# EAGLE design pic32 (EAGLE 5.12)
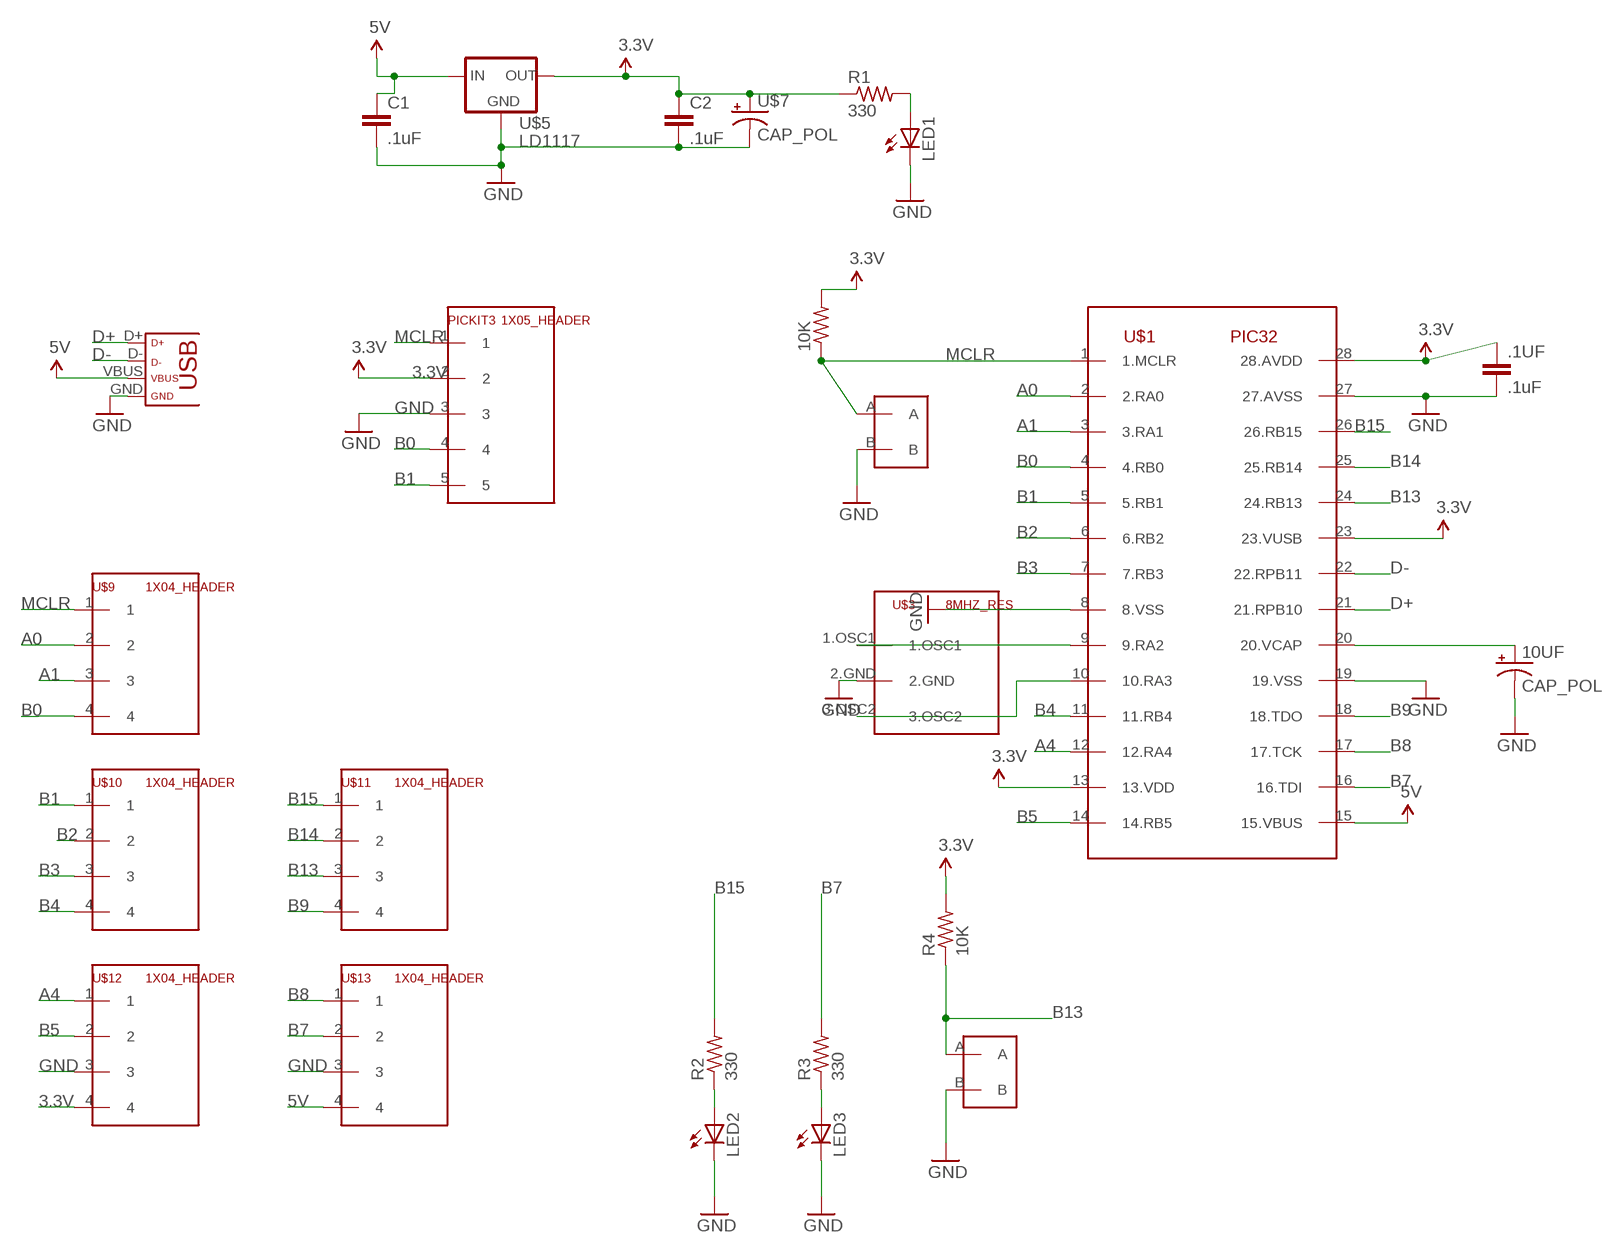
[diagram p0: schematic, sheet 1]

## Parts
10K  R-US_0309/12  [0309/12]
10UF  CAP_POL  [CAP_POL_D]
.1UF  .1uF  C-EU025-025X050  [C025-025X050]
C1  .1uF  C-EU025-025X050  [C025-025X050]
C2  .1uF  C-EU025-025X050  [C025-025X050]
LED1  LED3MM  [LED3MM]
LED2  LED3MM  [LED3MM]
LED3  LED3MM  [LED3MM]
PICKIT3  1X05_HEADER  [1X05]
R1  330  R-US_0309/12  [0309/12]
R2  330  R-US_0309/12  [0309/12]
R3  330  R-US_0309/12  [0309/12]
R4  10K  R-US_0309/12  [0309/12]
U$1  PIC32  [DIL28-4]
U$2  2_LEAD_PUSH  [2_LEAD_PUSH]
U$3  8MHZ_RES  [8MHZ_RES]
U$5  LD1117  [TO220]
U$7  CAP_POL  [CAP_POL_D]
U$8  2_LEAD_PUSH  [2_LEAD_PUSH]
U$9  1X04_HEADER  [1X04]
U$10  1X04_HEADER  [1X04]
U$11  1X04_HEADER  [1X04]
U$12  1X04_HEADER  [1X04]
U$13  1X04_HEADER  [1X04]
U$14  USB  [USB-MINIB]

## Nets
3.3V: 10K.2 .1UF.1 C2.1 PICKIT3.2 R1.1 R4.2 U$1.13(13.VDD) U$1.23(23.VUSB) U$1.28(28.AVDD) U$5.2(OUT) U$7.1(+) U$12.4
5V: C1.1 U$1.15(15.VBUS) U$5.3(IN) U$13.4 U$14.VBUS
A0: U$1.2(2.RA0) U$9.2
A1: U$1.3(3.RA1) U$9.3
A4: U$1.12(12.RA4) U$12.1
B0: PICKIT3.4 U$1.4(4.RB0) U$9.4
B1: PICKIT3.5 U$1.5(5.RB1) U$10.1
B2: U$1.6(6.RB2) U$10.2
B3: U$1.7(7.RB3) U$10.3
B4: U$1.11(11.RB4) U$10.4
B5: U$1.14(14.RB5) U$12.2
B7: R3.2 U$1.16(16.TDI) U$13.2
B8: U$1.17(17.TCK) U$13.1
B9: U$1.18(18.TDO) U$11.4
B13: R4.1 U$1.24(24.RB13) U$8.A U$11.3
B14: U$1.25(25.RB14) U$11.2
B15: R2.2 U$1.26(26.RB15) U$11.1
D+: U$1.21(21.RPB10) U$14.D+
D-: U$1.22(22.RPB11) U$14.D-
GND: 10UF.2(-) .1UF.2 C1.2 C2.2 LED1.K(C) LED2.K(C) LED3.K(C) PICKIT3.3 U$1.8(8.VSS) U$1.19(19.VSS) U$1.27(27.AVSS) U$2.B U$3.2.GND U$5.1(GND) U$7.2(-) U$8.B U$12.3 U$13.3 U$14.GND
MCLR: 10K.1 PICKIT3.1 U$1.1(1.MCLR) U$2.A U$9.1
N$1: LED3.A R3.1
N$2: U$1.9(9.RA2) U$3.1.OSC1
N$3: U$1.10(10.RA3) U$3.3.OSC2
N$5: LED1.A R1.2
N$6: 10UF.1(+) U$1.20(20.VCAP)
N$12: LED2.A R2.1

## Library data of the parts
10K R1-R4 = ME433:R-US_: RESISTOR, American symbol
10UF U$7 = ME433:CAP_POL
.1UF C1 C2 = ME433:C-EU: CAPACITOR, European symbol
LED1-LED3 = ME433:LED: LED OSRAM: - CHIPLED LG R971, LG N971, LY N971, LG Q971, LY Q971, LO R971, LY R971 LH N974, LH R974 LS Q976, LO Q976, LY Q976 LO Q996 - Hyper CHIPLED LW Q18S LB Q993, LB Q99A, LB R99A - SideLED LS A670, LO A670, LY A670, LG A670, LP A670 LB A673, LV A673, LT A673, LW A673 LH A674 LY A675 LS A676, LA A676, LO A676, LY A676, LW A676 LS A679, LY A679, LG A679 - Hyper Micro SIDELED® LS Y876, LA Y876, LO Y876, LY Y876 LT Y87S - SmartLED LW L88C, LW L88S LB L89C, LB L89S, LG L890 LS L89K, LO L89K, LY L89K LS L896, LA L896, LO L896, LY L896 - TOPLED LS T670, LO T670, LY T670, LG T670, LP T670 LSG T670, LSP T670, LSY T670, LOP T670, LYG T670 LG T671, LOG T671, LSG T671 LB T673, LV T673, LT T673, LW T673 LH T674 LS T676, LA T676, LO T676, LY T676, LB T676, LH T676, LSB T676, LW T676 LB T67C, LV T67C, LT T67C, LS T67K, LO T67K, LY T67K, LW E67C LS E67B, LA E67B, LO E67B, LY E67B, LB E67C, LV E67C, LT E67C LW T67C LS T679, LY T679, LG T679 LS T770, LO T770, LY T770, LG T770, LP T770 LB T773, LV T773, LT T773, LW T773 LH T774 LS E675, LA E675, LY E675, LS T675 LS T776, LA T776, LO T776, LY T776, LB T776 LHGB T686 LT T68C, LB T68C - Hyper Mini TOPLED® LB M676 - Mini TOPLED Santana® LG M470 LS M47K, LO M47K, LY M47K Source: http://www.osram.convergy.de LUXEON: - LUMILED® LXK2-PW12-R00, LXK2-PW12-S00, LXK2-PW14-U00, LXK2-PW14-V00 LXK2-PM12-R00, LXK2-PM12-S00, LXK2-PM14-U00 LXK2-PE12-Q00, LXK2-PE12-R00, LXK2-PE12-S00, LXK2-PE14-T00, LXK2-PE14-U00 LXK2-PB12-K00, LXK2-PB12-L00, LXK2-PB12-M00, LXK2-PB14-N00, LXK2-PB14-P00, LXK2-PB14-Q00 LXK2-PR12-L00, LXK2-PR12-M00, LXK2-PR14-Q00, LXK2-PR14-R00 LXK2-PD12-Q00, LXK2-PD12-R00, LXK2-PD12-S00 LXK2-PH12-R00, LXK2-PH12-S00 LXK2-PL12-P00, LXK2-PL12-Q00, LXK2-PL12-R00 Source: www.luxeon.com KINGBRIGHT: KA-3528ASYC Source: www.kingbright.com
PICKIT3 = ME433:1X05_HEADER
U$1 = ME433:PIC32
U$2 U$8 = ME433:2_LEAD_PUSH
U$3 = ME433:8MHZ_RES
U$5 = ME433:LD1117
U$9-U$13 = ME433:1X04_HEADER
U$14 = ME433:USB

## Board
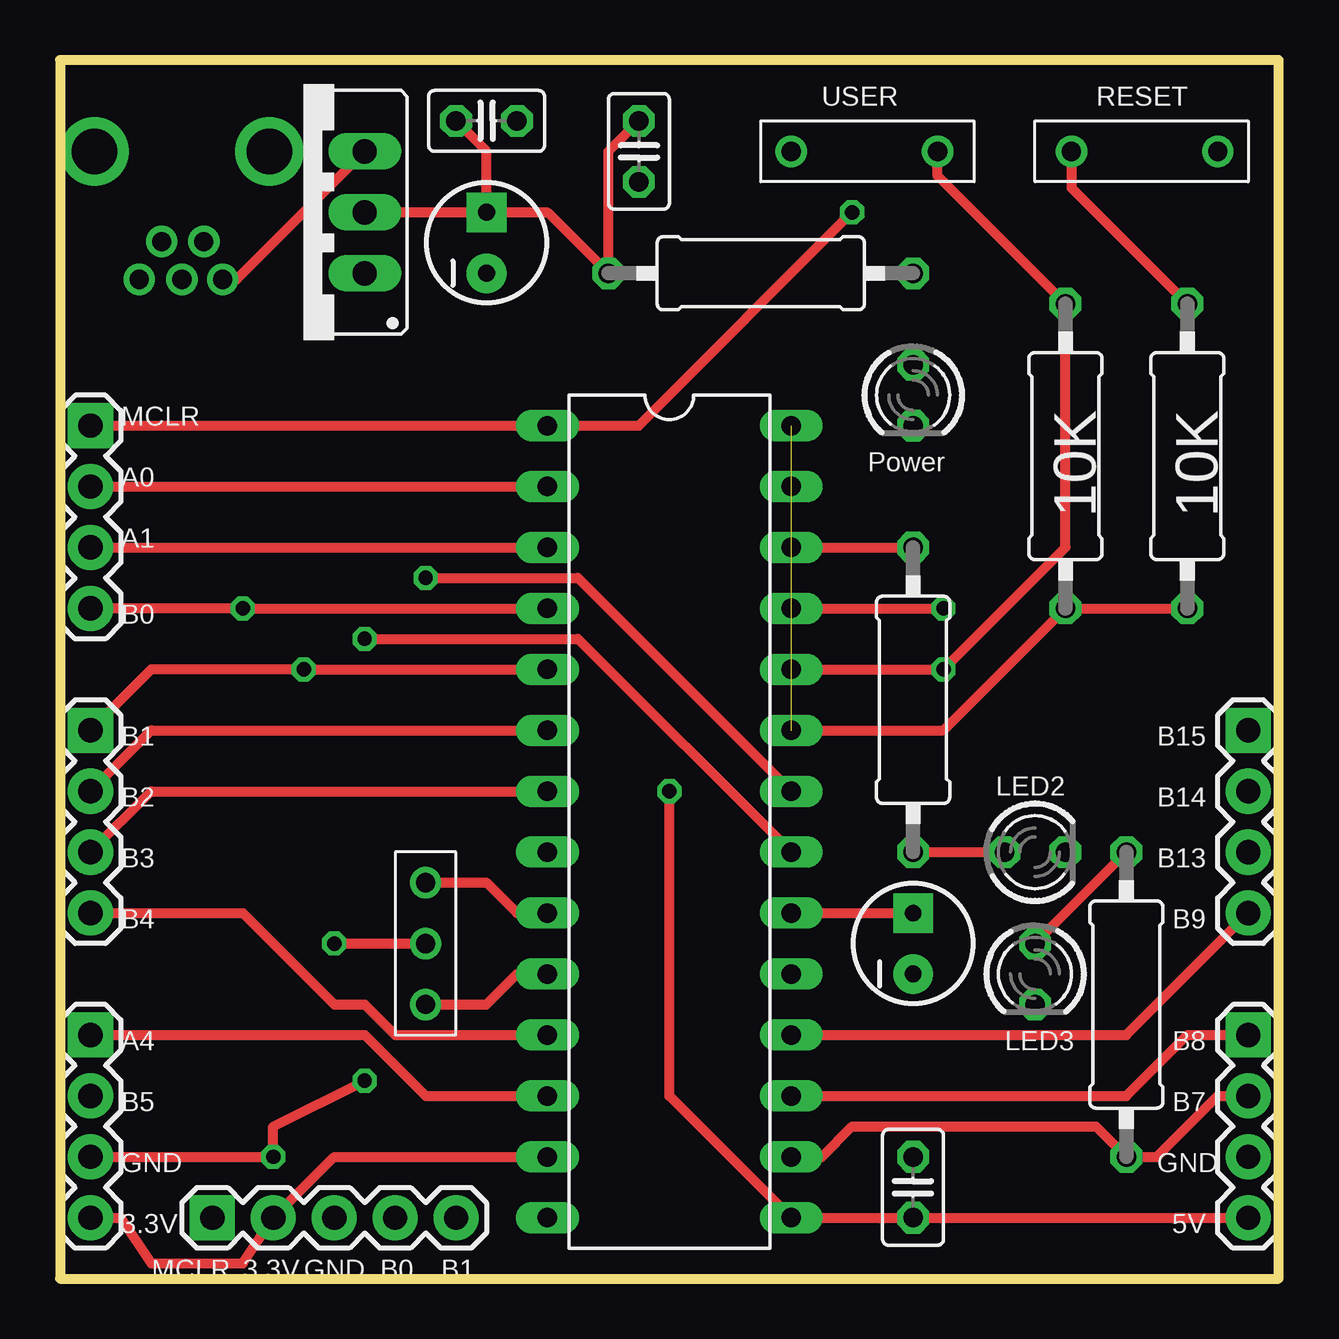
[diagram p1: board, top side]
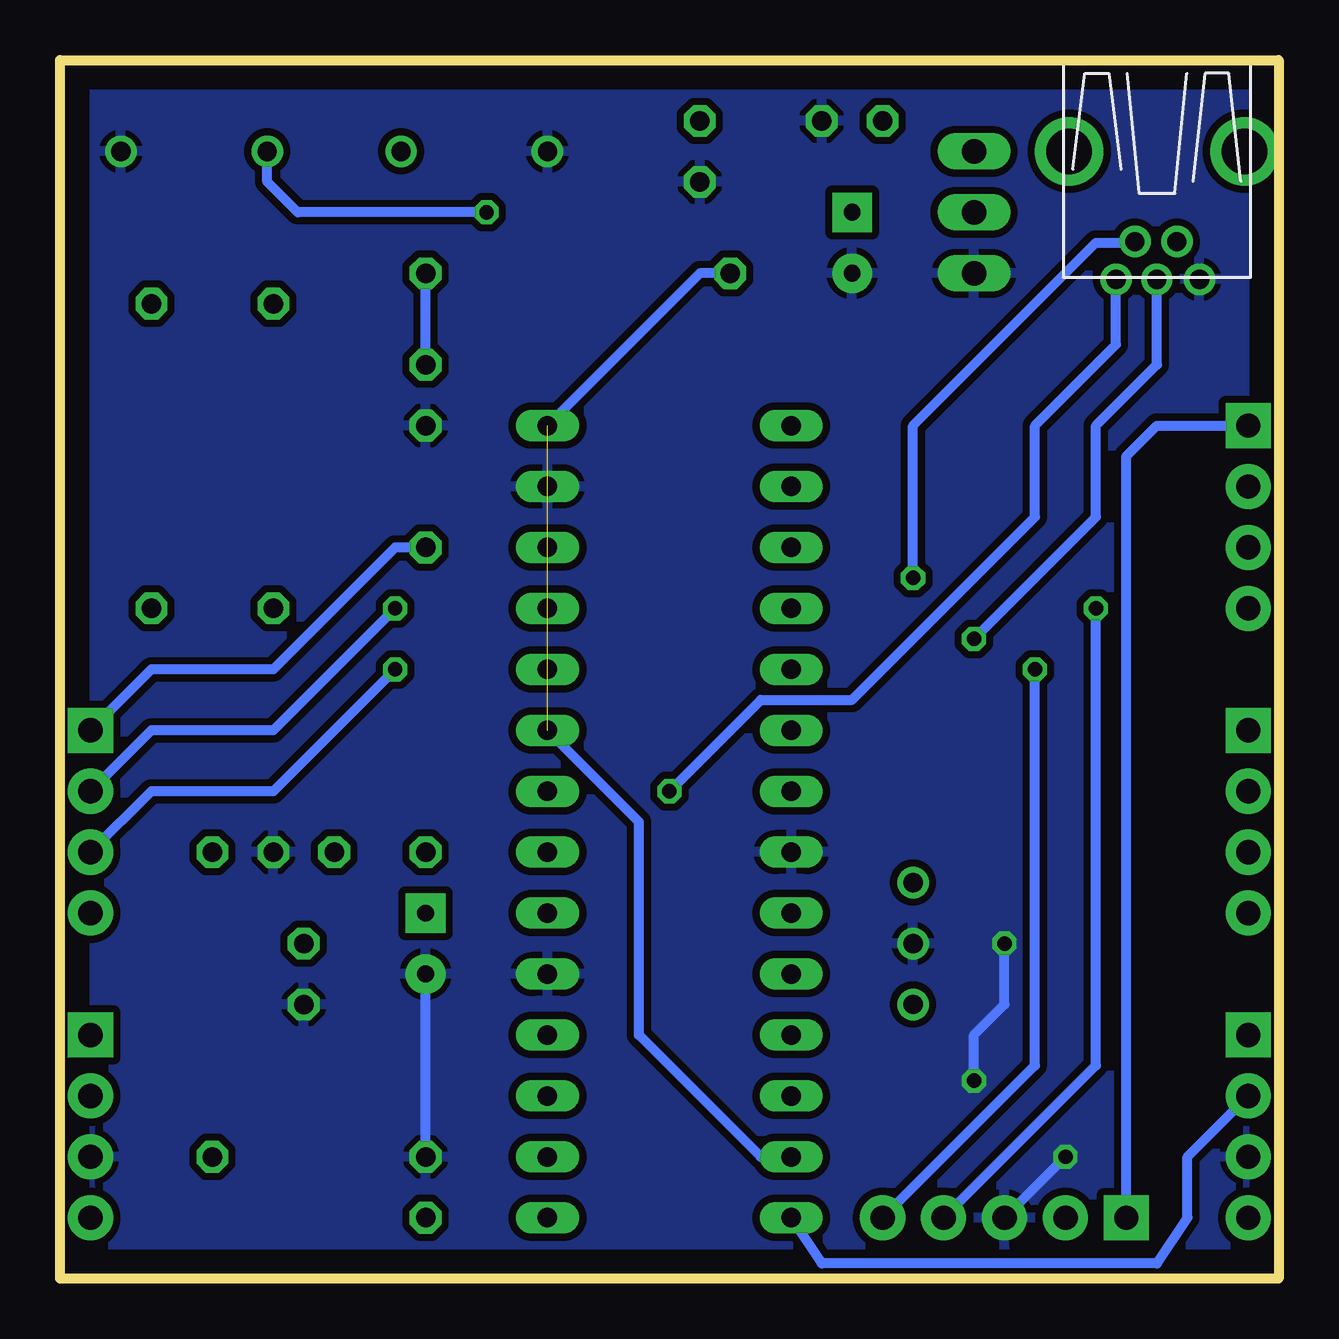
[diagram p2: board, bottom side, seen from below]

Size 50.8 x 50.8 mm. Coordinates in mm from the lower left corner, seen from the top.
Outline: 0,0 50.8,0 50.8,50.8 0,50.8 0,0
Copper layers (1*16): Top 0.035mm / dielectric 1.5mm / Bottom 0.035mm
Design rules "default": minimum track width 10mil, minimum drill 24mil, track to track 8mil, track to pad 8mil, pad to pad 8mil, via to via 8mil, smd to smd 8mil, copper to edge 40mil, drill to drill 8mil, minimum pad ring 10mil, minimum via ring 8mil, stop-mask expansion 4mil, vias tented up to drill 0mil, thermal gap 10mil

### Footprints (pad centres in the part's own frame; a part is rotated, then mirrored left to right if it is on the bottom)
0309/12 = drill 0.813 octagon: 1 -6.35,0; 2 6.35,0
CAP_POL_D = drill 0.7 pad 1.651 square: 1 1.27,0 | drill 0.7 pad 1.651 round: 2 -1.27,0
C025-025X050 = drill 0.813 octagon: 1 -1.27,0; 2 1.27,0
LED3MM = drill 0.813 octagon: A -1.27,0; K 1.27,0
1X05 = drill 1.016 pad 1.88 square: 1 0,0 | drill 1.016 pad 1.88 round: 2 2.54,0; 3 5.08,0; 4 7.62,0; 5 10.16,0
DIL28-4 = drill 0.813 long: 1 -16.51,-5.08; 2 -13.97,-5.08; 3 -11.43,-5.08; 4 -8.89,-5.08; 5 -6.35,-5.08; 6 -3.81,-5.08; 7 -1.27,-5.08; 8 1.27,-5.08; 9 3.81,-5.08; 10 6.35,-5.08; 11 8.89,-5.08; 12 11.43,-5.08; 13 13.97,-5.08; 14 16.51,-5.08; 15 16.51,5.08; 16 13.97,5.08; 17 11.43,5.08; 18 8.89,5.08; 19 6.35,5.08; 20 3.81,5.08; 21 1.27,5.08; 22 -1.27,5.08; 23 -3.81,5.08; 24 -6.35,5.08; 25 -8.89,5.08; 26 -11.43,5.08; 27 -13.97,5.08; 28 -16.51,5.08
2_LEAD_PUSH = drill 0.8 round: A -6.1,0; B 0,0
8MHZ_RES = drill 0.8 round: 1.OSC1 -2.54,0; 2.GND 0,0; 3.OSC2 2.54,0
TO220 = drill 1.016 long: 1 -2.54,0; 2 0,0; 3 2.54,0
1X04 = drill 1.016 pad 1.88 square: 1 0,0 | drill 1.016 pad 1.88 round: 2 2.54,0; 3 5.08,0; 4 7.62,0
USB-MINIB = drill 0.8 round: D+ 4.064,0; D- 2.489,0.914; GND 4.064,-1.778; ID 2.489,-0.838; VBUS 4.064,1.702 | drill 1.9 round: P$6 -1.27,-3.65; P$7 -1.27,3.65

### Placement (x,y rotation side)
10K  46.99,34.29 270 top
10UF  35.56,13.97 90 top
.1UF  24.13,46.99 270 top
C1  35.56,3.81 90 top
C2  17.78,48.26 0 top
LED1  35.56,36.83 270 top
LED2  40.64,17.78 0 top
LED3  40.64,12.7 270 top
PICKIT3  6.35,2.54 0 top
R1  29.21,41.91 0 top
R2  35.56,24.13 90 top
R3  44.45,11.43 270 top
R4  41.91,34.29 270 top
U$1  25.4,19.05 270 top
U$2  48.26,46.99 0 top
U$3  15.24,13.97 270 top
U$5  12.7,44.45 90 top
U$7  17.78,43.18 90 top
U$8  30.48,46.99 180 top
U$9  1.27,35.56 270 top
U$10  1.27,22.86 270 top
U$11  49.53,22.86 270 top
U$12  1.27,10.16 270 top
U$13  49.53,10.16 270 top
U$14  5.08,45.72 270 top

### Tracks (layer width: path | path; a pad name or v marks a point on that pad's centre or on a via)
3.3V  (1 unrouted)
  Top 0.406: U$5.2 U$7.1 | U$7.1 17.78,46.99 C2.1 | U$7.1 20.32,44.45 R1.1 22.86,46.99 .1UF.1 | 10K.2 R4.2 36.83,22.86 U$1.23 | U$1.13 11.43,5.08 PICKIT3.2 7.62,0.64 3.81,0.64 2.54,2.54 U$12.4
  Bottom 0.406: R1.1 24.13,41.91 U$1.28 | U$1.13 21.59,5.08 26.67,10.16 26.67,19.05 U$1.23
5V  (via drill 0.6)
  Top 0.406: U$13.4 C1.1 U$1.15 25.4,7.62 v25.4,20.32 | U$14.VBUS 7.37,41.66 U$5.3
  Bottom 0.406: U$14.VBUS 6.78,38.94 10.16,35.56 10.16,31.75 17.78,24.13 21.59,24.13 v25.4,20.32
A0
  Top 0.406: U$9.2 U$1.2
A1
  Top 0.406: U$9.3 U$1.3
A4
  Top 0.406: U$12.1 12.7,10.16 15.24,7.62 U$1.12
B0  (via drill 0.6)
  Top 0.406: U$9.4 v7.62,27.94 U$1.4
  Bottom 0.406: PICKIT3.4 7.62,8.89 v7.62,27.94
B1  (via drill 0.6)
  Top 0.406: U$1.5 v10.16,25.4 3.81,25.4 U$10.1
  Bottom 0.406: PICKIT3.5 10.16,8.89 v10.16,25.4
B2
  Top 0.406: U$10.2 3.81,22.86 U$1.6
B3
  Top 0.406: U$1.7 3.81,20.32 U$10.3
B4
  Top 0.406: U$10.4 7.62,15.24 11.43,11.43 12.7,11.43 13.97,10.16 U$1.11
B5
  Bottom 0.406: U$1.14 19.05,0.64 5.08,0.64 3.81,2.54 3.81,5.08 U$12.2
B7
  Top 0.406: U$13.2 48.26,7.62 45.72,5.08 R3.2 43.18,6.35 33.02,6.35 31.75,5.08 U$1.16
B8
  Top 0.406: U$1.17 44.45,7.62 46.99,10.16 U$13.1
B9
  Top 0.406: U$1.18 44.45,10.16 U$11.4
B13  (via drill 0.6)
  Top 0.406: U$8.A 36.58,45.97 R4.1 41.91,30.48 v36.83,25.4 U$1.24
  Bottom 0.406: v36.83,25.4 41.91,20.32 46.99,20.32 U$11.3
B14  (via drill 0.6)
  Top 0.406: U$1.25 v36.83,27.94
  Bottom 0.406: v36.83,27.94 41.91,22.86 46.99,22.86 U$11.2
B15
  Top 0.406: U$1.26 R2.2
  Bottom 0.406: R2.2 36.83,30.48 41.91,25.4 46.99,25.4 U$11.1
D+  (via drill 0.6)
  Top 0.406: v12.7,26.67 21.59,26.67 U$1.21
  Bottom 0.406: U$14.D+ 5.08,38.1 7.62,35.56 7.62,31.75 v12.7,26.67
D-  (via drill 0.6)
  Top 0.406: U$1.22 21.59,29.21 v15.24,29.21
  Bottom 0.406: v15.24,29.21 15.24,35.56 7.62,43.18 6.04,43.18 U$14.D-
GND  (via drill 0.6)
  Top 0.406: U$12.3 v8.89,5.08 8.89,6.35 v12.7,8.26 | v11.43,13.97 U$3.2.GND
  Bottom 0.406: C1.2 10UF.2 | v8.89,5.08 PICKIT3.3 | v12.7,8.26 12.7,10.16 11.43,11.43 v11.43,13.97
  pour Bottom (isolate 0.305): -1.27,52.07 -1.27,-1.27 52.07,-1.27 52.07,-2.54 53.34,-2.54 53.34,52.07
MCLR  (via drill 0.6)
  Top 0.406: U$2.A 42.16,45.47 10K.1 | U$9.1 U$1.1 24.13,35.56 v33.02,44.45
  Bottom 0.406: U$9.1 5.08,35.56 6.35,34.29 PICKIT3.1 | v33.02,44.45 40.89,44.45 42.16,45.72 U$2.A
N$1
  Top 0.406: LED3.A R3.1
N$2
  Top 0.406: U$1.9 19.05,15.24 17.78,16.51 U$3.1.OSC1
N$3
  Top 0.406: U$1.10 19.05,12.7 17.78,11.43 U$3.3.OSC2
N$5
  Bottom 0.406: LED1.A R1.2
N$6
  Top 0.406: U$1.20 10UF.1
N$12
  Top 0.406: R2.1 LED2.A

### Text on the board
tPlace: USER | RESET | MCLR | Power | A0 | 10K | 10K | A1 | B0 | B1 | B15 | LED2 | B2 | B14 | B3 | B13 | B4 | B9 | A4 | LED3 | B8 | B5 | B7 | GND | GND | 3.3V | 5V | MCLR | 3.3V | GND | B0 | B1